# EasyEDA schematic Riego 2.0.json
TITLE: Sheet_1; REV: 1.0; Date: 2021-02-21; Sheet: 1/1; Drawn By: Migue27au; Company: Your Company
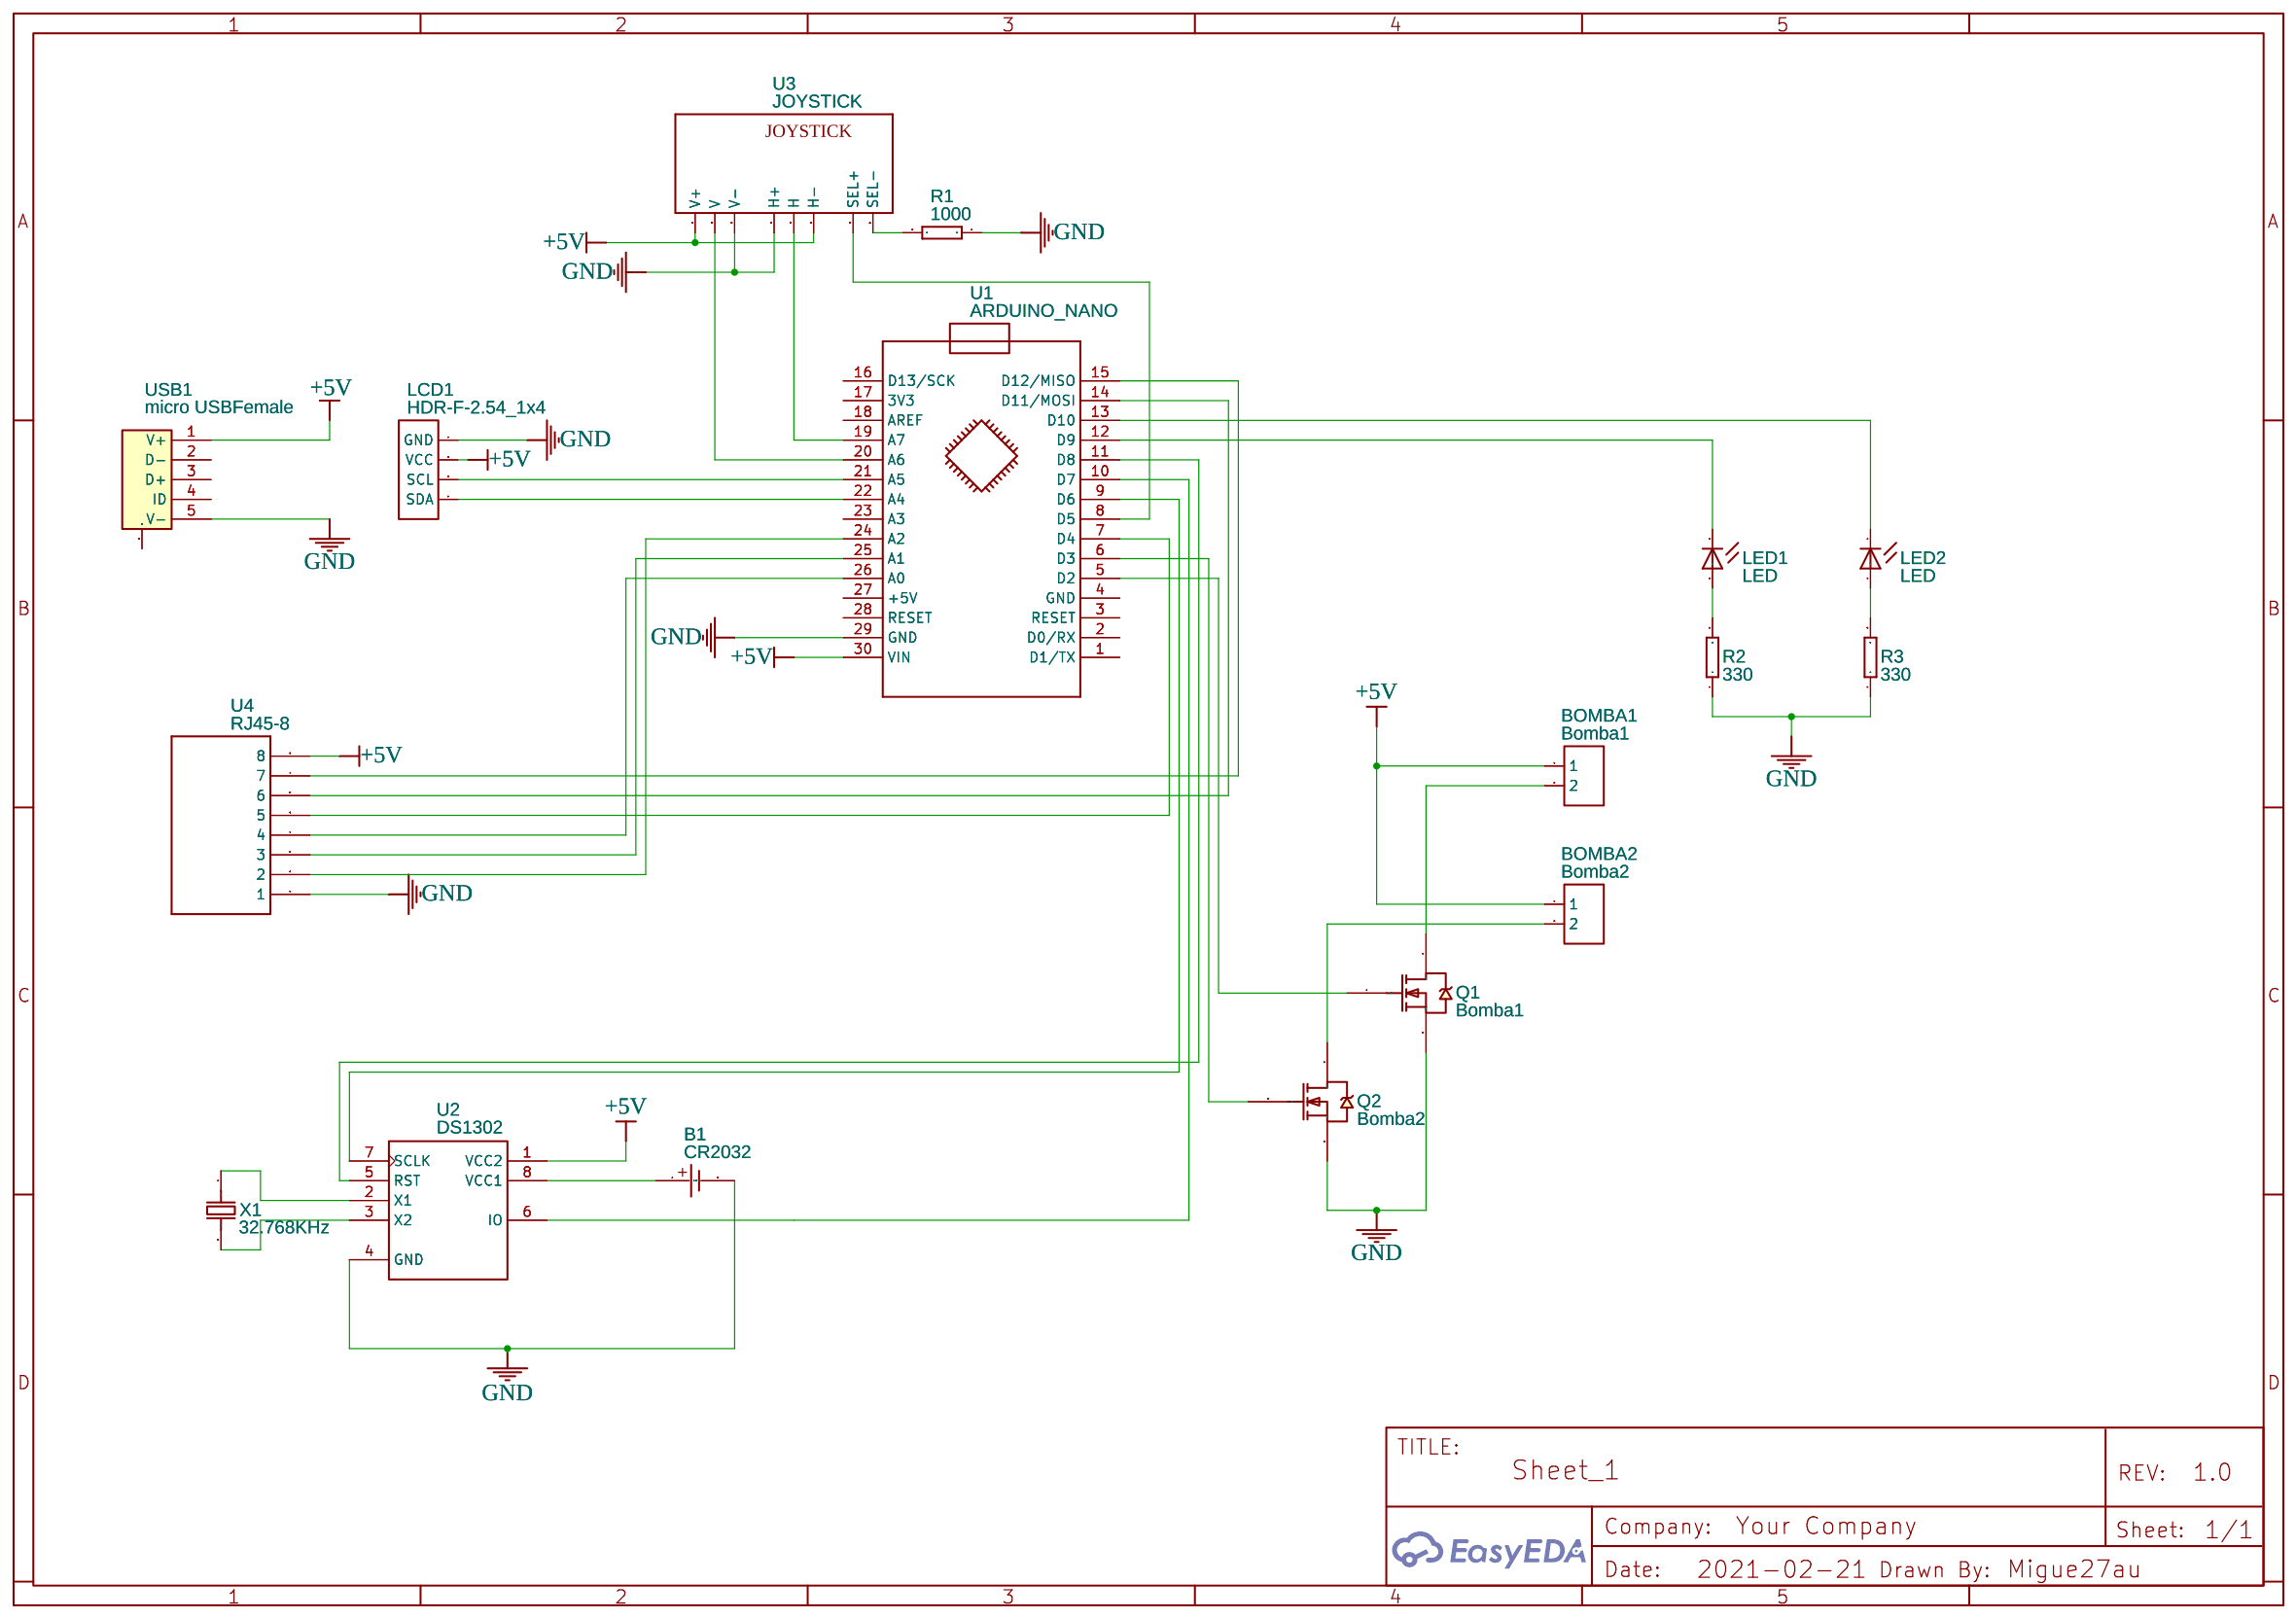
[diagram p0: schematic sheet]

## Parts
B1  CR2032  [BATTERY-1]
BOMBA1  Bomba1  [CONN-TH_2P-P5.08]
BOMBA2  Bomba2  [CONN-TH_2P-P5.08]
LCD1  HDR-F-2.54_1x4  [HDR-F-2.54_1X4]
LED1  LED  [LD260]
LED2  LED  [LD260]
Q1  Bomba1  [TO-220AB]
Q2  Bomba2  [TO-220AB]
R1  1000  [RTH025W]
R2  330  [RTH025W]
R3  330  [RTH025W]
U1  ARDUINO_NANO  [ARDUINO_NANO]
U2  DS1302  [DIP-08-300-ELL]
U3  JOYSTICK  [JOYSTICK]
U4  RJ45-8  [RJ45-8]
USB1  micro USBFemale  [MICRO-USB-SMD_5P-P0.65-H-F_C10418]
X1  32.768KHz  [OSC-TH_BD3.0-P1.10-D0.4]

## Library data of the parts
B1 = CR2032: Supplier Part: C70376; Supplier: LCSC; Manufacturer: Q&J; Manufacturer Part: BS-2-1
BOMBA1 BOMBA2 = CONN-TH_2P-P5.08: Supplier: LCSC; Contributor: LCEDA_Lib
LCD1 = HDR-F-2.54_1x4: Supplier Part: C225501; Supplier: LCSC; Contributor: LCEDA_Lib
LED1 LED2 = LED: Contributor: Adafruit
Q1 Q2 = IRF740: HEXFET N-Channel Power MOSFET
R1-R3 = RESISTOR: Contributor: DangerousPrototype
U1 = ARDUINO_NANO: sourceId: KGSeAWhDB
U2 = DS1302: Trickle Charge Timekeeping Chip
U3 = JOYSTICK: Contributor: SparkFun
U4 = RJ45-8: Contributor: SparkFun
USB1 = micro USBFemale: Supplier: LCSC; Manufacturer: ValuePro; image: //image.lceda.cn/szlcsc/C10418.jpg; Supplier Part: C10418
X1 = DT-38 32.768KHZ COPY: Supplier: LCSC; Manufacturer: KDS; Manufacturer Part: DT-38 32.768KHz; Supplier Part: C93228

## Nets
+5V: BOMBA1.1 BOMBA2.1 LCD1.3(VCC) U1.30(VIN) U2.1(VCC2) U3.H3(H-) U3.V1(V+) U4.8 USB1.1(V+)
GND: B1.2 LCD1.4(GND) Q1.3(S) Q2.3(S) R1.1 R2.1 R3.1 U1.29(GND) U2.4(GND) U3.H1(H+) U3.V3(V-) U4.1 USB1.5(V-)
Net-(B1-1): B1.1 U2.8(VCC1)
Net-(BOMBA1-2): BOMBA1.2 Q1.2(D)
Net-(BOMBA2-2): BOMBA2.2 Q2.2(D)
Net-(LCD1-1): LCD1.1(SDA) U1.22(A4)
Net-(LCD1-2): LCD1.2(SCL) U1.21(A5)
Net-(LED1-A): LED1.A R2.2
Net-(LED1-K): LED1.K(C) U1.12(D9)
Net-(LED2-A): LED2.A R3.2
Net-(LED2-K): LED2.K(C) U1.13(D10)
Net-(Q1-1): Q1.1(G) U1.5(D2)
Net-(Q2-1): Q2.1(G) U1.6(D3)
Net-(R1-2): R1.2 U3.B2A(SEL-)
Net-(U1-7): U1.7(D4) U4.5
Net-(U1-8): U1.8(D5) U3.B1A(SEL+)
Net-(U1-9): U1.9(D6) U2.7(SCLK)
Net-(U1-10): U1.10(D7) U2.6(IO)
Net-(U1-11): U1.11(D8) U2.5(RST)
Net-(U1-14): U1.14(D11/MOSI) U4.6
Net-(U1-15): U1.15(D12/MISO) U4.7
Net-(U1-19): U1.19(A7) U3.H2(H)
Net-(U1-20): U1.20(A6) U3.V2(V)
Net-(U1-24): U1.24(A2) U4.2
Net-(U1-25): U1.25(A1) U4.3
Net-(U1-26): U1.26(A0) U4.4
Net-(U2-2): U2.2(X1) X1.1
Net-(U2-3): U2.3(X2) X1.2

Not connected (* = marked no-connect by the designer): U1 1(D1/TX) 2(D0/RX) 3(RESET) 4(GND) 16(D13/SCK) 17(3V3) 18(AREF) 23(A3) 27(+5V) 28(RESET); USB1 0(MTN) 2(D-) 3(D+) 4(ID)
